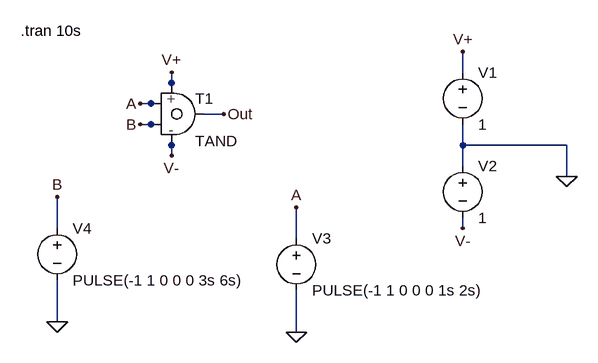
[diagram p0: schematic Test_TAND.asc]
Test_TAND.asc, the LTspice schematic file:
Version 4
SHEET 1 880 680
WIRE 528 128 528 96
WIRE 80 160 80 128
WIRE 64 176 32 176
WIRE 160 192 128 192
WIRE 64 208 32 208
WIRE 528 240 528 208
WIRE 688 240 528 240
WIRE 80 256 80 224
WIRE 528 272 528 240
WIRE 688 288 688 240
WIRE -96 368 -96 320
WIRE 528 368 528 352
WIRE 272 384 272 336
WIRE -96 512 -96 448
WIRE 272 528 272 464
FLAG 688 288 0
FLAG 528 96 V+
FLAG 528 368 V-
FLAG 272 528 0
FLAG 272 336 A
FLAG -96 512 0
FLAG -96 320 B
FLAG 80 128 V+
FLAG 80 256 V-
FLAG 32 176 A
FLAG 32 208 B
FLAG 160 192 Out
SYMBOL TAND 80 192 R0
WINDOW 3 36 -2 Invisible 2
WINDOW -1 36 20 Left 2
WINDOW 38 36 42 Left 2
SYMATTR InstName T1
SYMATTR Value 0
SYMATTR Value2 0
SYMBOL Voltage 528 112 R0
SYMATTR InstName V1
SYMATTR Value 1
SYMBOL voltage 528 256 R0
SYMATTR InstName V2
SYMATTR Value 1
SYMBOL voltage 272 368 R0
SYMATTR InstName V3
SYMATTR Value PULSE(-1 1 0 0 0 1s 2s)
SYMBOL voltage -96 352 R0
SYMATTR InstName V4
SYMATTR Value PULSE(-1 1 0 0 0 3s 6s)
TEXT -152 64 Left 2 !.tran 10s

The netlist it stands for:
* Test_TAND.asc
T1 Out V+ V- A B TAND 0 0
V1 V+ 0 1
V2 0 V- 1
V3 A 0 PULSE(-1 1 0 0 0 1s 2s)
V4 B 0 PULSE(-1 1 0 0 0 3s 6s)
.tran 10s
.backanno
.end